# EAGLE schematic RoomSensor (EAGLE 7.3.0)
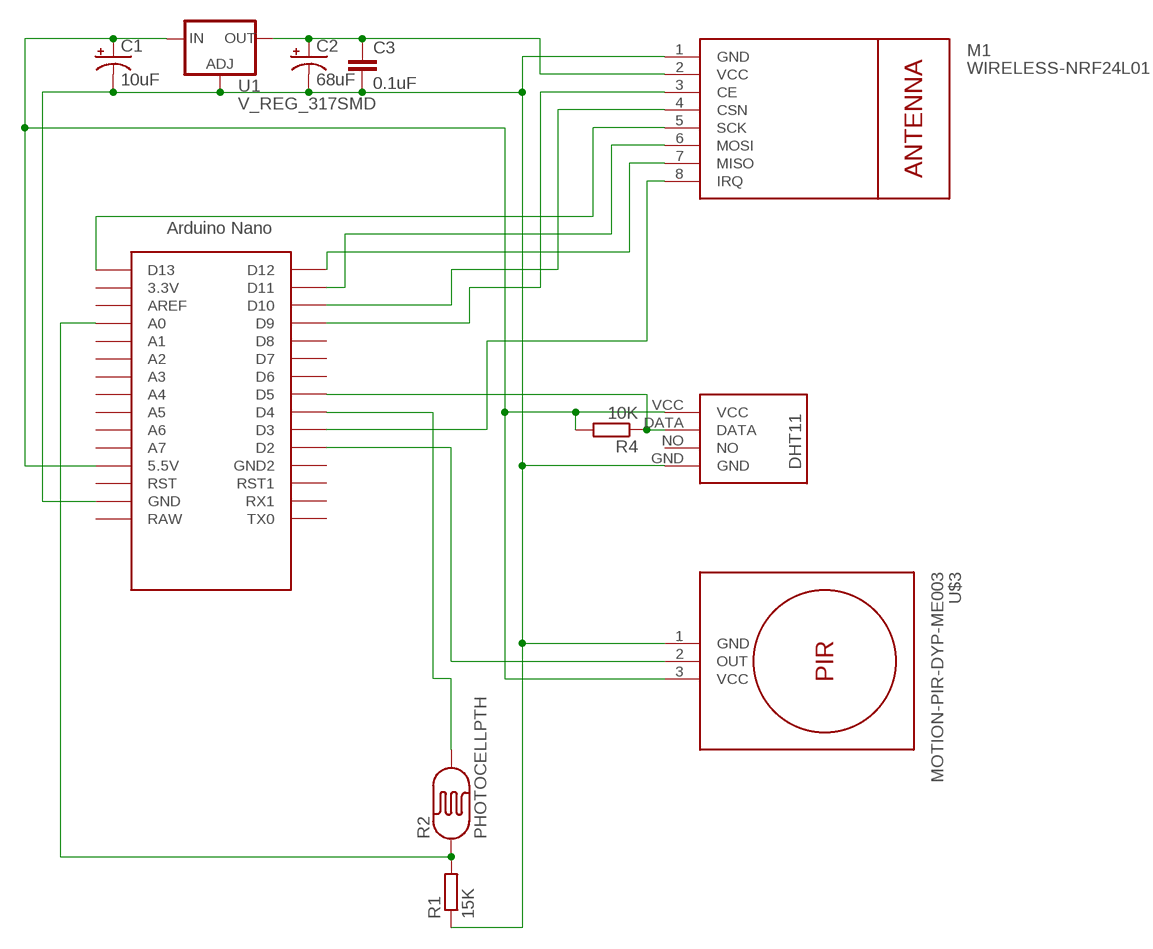
[diagram p0: schematic, sheet 1]

## Parts
C1  10uF  CAP_POL1206  [EIA3216]
C2  68uF  CAP_POL1206  [EIA3216]
C3  0.1uF  CAP0603-CAP  [0603-CAP]
M1  WIRELESS-NRF24L01  [WIRELESS-NRF24L01]
R1  15K  R-EU_0204/2V  [0204V]
R2  PHOTOCELLPTH  [PHOTOCELL]
R4  10K  R-EU_0204/2V  [0204V]
U1  V_REG_317SMD  [SOT223]
U$1  NANO  [NANO]
U$2  DHT11  [DHT11]
U$3  MOTION-PIR-DYP-ME003  [MOTION-PIR-DYP-ME003]

## Nets
N$1: R1.2 R2.1 U$1.A0
N$2: C1.A(+) R4.2 U1.3(IN) U$1.5V(5.5V) U$2.VCC U$3.3(VCC)
N$3: C1.C(-) C2.C(-) C3.2 M1.1(GND) R1.1 U1.1(ADJ) U$1.GND U$2.GND U$3.1(GND)
N$4: R4.1 U$1.D5 U$2.DATA
N$5: C2.A(+) C3.1 M1.2(VCC) U1.2(OUT)
N$6: M1.3(CE) U$1.D9
N$7: M1.4(CSN) U$1.D10
N$8: M1.7(MISO) U$1.D12
N$9: M1.6(MOSI) U$1.D11
N$10: M1.5(SCK) U$1.D13
N$11: U$1.D2 U$3.2(OUT)
N$12: R2.2 U$1.D4
N$13: M1.8(IRQ) U$1.D3
Unconnected: U$1.3.3V U$1.A1 U$1.A2 U$1.A3 U$1.A4 U$1.A5 U$1.A6 U$1.A7 U$1.AREF U$1.D6 U$1.D7 U$1.D8 U$1.GND1(GND2) U$1.ICSP1 U$1.ICSP2 U$1.ICSP3 U$1.ICSP4 U$1.ICSP5 U$1.ICSP6 U$1.RAW U$1.RST U$1.RST1 U$1.RX1 U$1.TX0 U$2.NO

## Library data of the parts
C1 C2 = SparkFun-Passives:CAP_POL: Capacitor Polarized These are standard SMD and PTH capacitors. Normally 10uF, 47uF, and 100uF in electrolytic and tantalum varieties. Always verify the external diameter of the through hole cap, it varies with capacity, voltage, and manufacturer. The EIA devices should be standard.
C3 = SparkFun-Passives:CAP: Capacitor Standard 0603 ceramic capacitor, and 0.1" leaded capacitor.
M1 = diy-modules:WIRELESS-NRF24L01: 2.4 GHz Wireless Module based on NRF24L01 chip
R1 R4 = resistor:R-EU_: RESISTOR, European symbol
R2 = SparkFun-Sensors:PHOTOCELL: CdS photoresistor. This is a low cost way to detect light levels. Resistance decreases with more incoming light. SparkFun SKU: SEN-09088
U1 = SparkFun-PowerIC:V_REG_317: Voltage Regulator Standard LM317 adjustable voltage regulator. AOI (Adjust Output Input). Google 'LM317 Calculator' for easy to use app to get the two resistor values needed. 240/720 for 5V output. 240/390 for 3.3V output. Spark Fun Electronics SKU : COM-00527
U$1 = Arduino-clone:NANO: Arduino Nano
U$2 = DHT11:DHT11: DHT11 Czujnik temperatury i wilgotności
U$3 = diy-modules:MOTION-PIR-DYP-ME003: PIR Motion Sensor Module DYP-ME003 based on BISS0001 pyroelectic detector